# EAGLE design encoder (EAGLE 6.4)
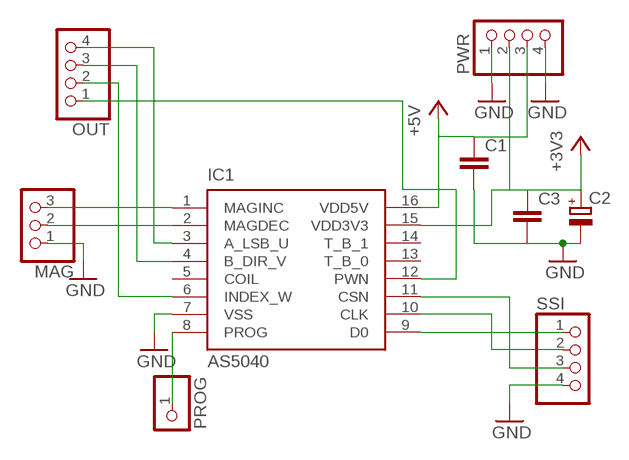
[diagram p0: schematic, sheet 1]

## Parts
C1  C-EUC0805  [C0805]
C2  CPOL-EUE2,5-6E  [E2,5-6E]
C3  C-EUC0805  [C0805]
IC1  AS5040  [SSOP16]
MAG  PINHD-1X3  [1X03]
OUT  PINHD-1X4  [1X04]
PROG  PINHD-1X1  [1X01]
PWR  PINHD-1X4  [1X04]
SSI  PINHD-1X4  [1X04]

## Nets
+3V3: C2.+ C3.1 IC1.15(VDD3V3) PWR.2
+5V: C1.1 IC1.16(VDD5V) PWR.3
GND: C1.2 C2.- C3.2 IC1.7(VSS) MAG.1 PWR.1 PWR.4 SSI.4
N$1: IC1.11(CSN) SSI.3
N$2: IC1.3(A_LSB_U) OUT.4
N$3: IC1.4(B_DIR_V) OUT.3
N$4: IC1.6(INDEX_W) OUT.2
N$5: IC1.12(PWN) OUT.1
N$6: IC1.2(MAGDEC) MAG.2
N$7: IC1.1(MAGINC) MAG.3
N$8: IC1.10(CLK) SSI.2
N$9: IC1.9(D0) SSI.1
N$10: IC1.8(PROG) PROG.1
Unconnected: IC1.5(COIL) IC1.13(T_B_0) IC1.14(T_B_1)

## Library data of the parts
C1 C3 = rcl:C-EU: CAPACITOR, European symbol
C2 = rcl:CPOL-EU: POLARIZED CAPACITOR, European symbol
IC1 = austriamicrosystems:AS5040: 10-BIT PROGRAMMABLE MAGNETIC ROTARY ENCODER Source: www.austriamicrosystems.com .. AS5040DataSheetRev12.pdf; MPN: AS5040ASSU; OC_FARNELL: 1630800; OC_NEWARK: 59P4059
MAG = pinhead:PINHD-1X3: PIN HEADER
OUT PWR SSI = pinhead:PINHD-1X4: PIN HEADER
PROG = pinhead:PINHD-1X1: PIN HEADER

## Board
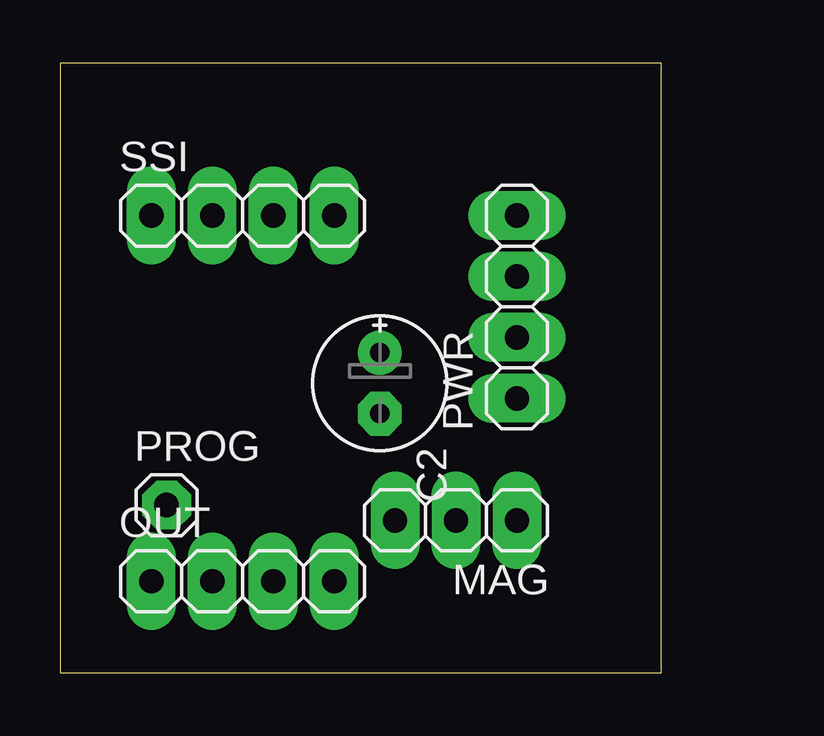
[diagram p1: board, top side]
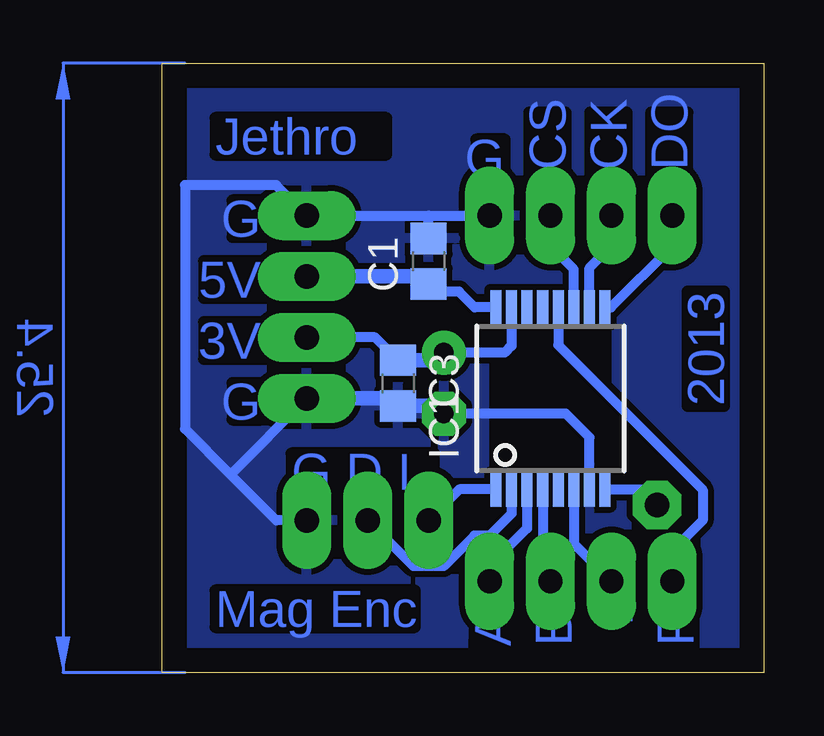
[diagram p2: board, bottom side, seen from below]

Size 25.07 x 25.39 mm. Coordinates in mm from the lower left corner, seen from the top.
Outline: 0,0 25.07,0 25.07,25.39 0,25.39 0,0
Copper layers (1*16): Top 0.035mm / dielectric 1.5mm / Bottom 0.035mm
Design rules "default *": minimum track width 8mil, minimum drill 24mil, track to track 10mil, track to pad 10mil, pad to pad 10mil, via to via 10mil, smd to smd 10mil, copper to edge 40mil, drill to drill 8mil, minimum pad ring 20mil, minimum via ring 16mil, stop-mask expansion 4mil, vias tented up to drill 0mil, thermal gap 10mil
bRestrict: area 6.4,8.9 to 11.4,14; area 0,26.4 to 1.5,27; area 23.9,26.4 to 25.4,27; area 9.9,27.1 to 15.5,28.8; 3 lines

### Footprints (pad centres in the part's own frame; a part is rotated, then mirrored left to right if it is on the bottom)
C0805 = smd 1.3 x 1.5: 1 -0.95,0; 2 0.95,0
E2,5-6E = drill 0.813 pad 1.575: + -1.27,0 | drill 0.813 pad 1.575 octagon: - 1.27,0
SSOP16 = smd 0.46 x 1.43: 1 -2.275,-3.795; 2 -1.625,-3.795; 3 -0.975,-3.795; 4 -0.325,-3.795; 5 0.325,-3.795; 6 0.975,-3.795; 7 1.625,-3.795; 8 2.275,-3.795; 9 2.275,3.795; 10 1.625,3.795; 11 0.975,3.795; 12 0.325,3.795; 13 -0.325,3.795; 14 -0.975,3.795; 15 -1.625,3.795; 16 -2.275,3.795
1X03 = drill 1.016 long: 1 -2.54,0; 2 0,0; 3 2.54,0
1X04 = drill 1.016 long: 1 -3.81,0; 2 -1.27,0; 3 1.27,0; 4 3.81,0
1X01 = drill 1.016 octagon: 1 0,0

### Placement (x,y rotation side)
C1  13.97,17.14 90 bottom
C2  13.34,12.06 270 top
C3  15.24,12.06 270 bottom
IC1  8.89,11.43 0 bottom
MAG  16.51,6.35 180 top
OUT  7.62,3.81 0 top
PROG  4.45,6.98 0 top
PWR  19.05,15.24 90 top
SSI  7.62,19.05 0 top

### Tracks (layer width: path | path; a pad name or v marks a point on that pad's centre or on a via)
+3V3
  Bottom 0.406: IC1.15 10.52,13.62 10.8,13.33 C2.+ | C3.1 16.2,13.97 PWR.2
  Bottom 0.61: C2.+ 13.66,13.01 C3.1
+5V
  Bottom 0.406: IC1.16 12.05,15.22 12.7,15.87 13.65,15.87 C1.1 14.29,16.51
  Bottom 0.61: PWR.3 14.29,16.51
GND
  Bottom 0.406: IC1.7 7.27,9.8 8.26,10.79 C2.- | C3.2 15.55,11.43 | 13.97,19.05 PWR.4 20.32,20.32 24.13,20.32 24.13,10.16 22.23,8.25 | 13.97,19.05 SSI.4 | C1.2 13.97,19.05 | MAG.1 20.32,6.35 22.23,8.25 | PWR.1 22.23,8.25
  Bottom 0.61: C2.- 13.66,11.12 C3.2 | 15.55,11.43 PWR.1
  pour Bottom: 0,25.4 24.13,25.4 24.13,0 0,0
N$1
  Bottom 0.406: IC1.11 7.91,16.8 8.89,17.78 SSI.3
N$2
  Bottom 0.406: OUT.4 11.43,4.45 9.87,6.01 IC1.3
N$3
  Bottom 0.406: IC1.4 9.22,4.13 OUT.3
N$4
  Bottom 0.406: IC1.6 7.91,5.38 OUT.2
N$5
  Bottom 0.406: 3.81,5.08 2.54,6.35 2.54,7.62 8.57,13.64 IC1.12
  Bottom 0.61: OUT.1 3.81,5.08
N$6
  Bottom 0.406: IC1.2 10.52,6.63 11.43,5.71 12.07,5.71 13.34,4.45 14.61,4.45 MAG.2
N$7
  Bottom 0.406: IC1.1 12.69,7.63 MAG.3
N$8
  Bottom 0.406: IC1.10 7.27,16.87 6.35,17.78 SSI.2
N$9
  Bottom 0.406: IC1.9 6.37,15.22 3.81,17.78 SSI.1
N$10
  Bottom 0.406: IC1.8 5.1,7.63 PROG.1
(copper drawn outside any net)
  shapes: Bottom area x1

### Text on the board
Bottom: G | DO | CK | CS | Jethro | G | 5V | 2013 | 3V | G | G D I | P | I | B | A | Mag Enc